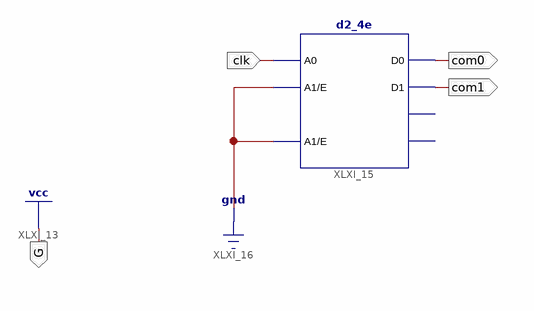
[diagram p0: schematic sheet 1]
// Xilinx ISE schematic no2.sch (spartan6) as structural Verilog: 1 symbols, 4 ports
module no2 (
  input  clk,
  output G,
  output com0,
  output com1
);

  d2_4e XLXI_15 (.A0(clk), .A1(1'b0), .E(1'b0), .D0(com0), .D1(com1));  // open: D2, D3

  assign G = 1'b1;
endmodule
